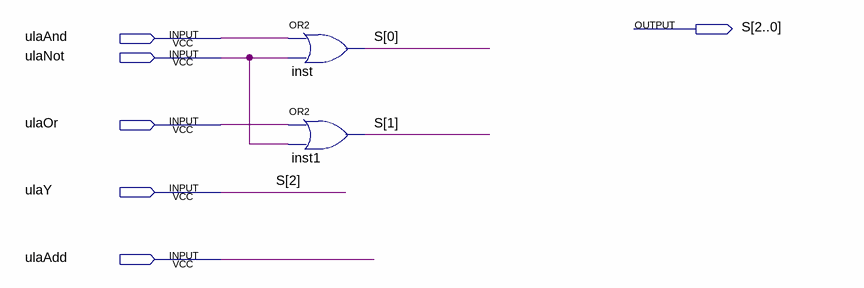
[diagram p0: schematic sheet]
// Quartus schematic codificador.bdf as structural Verilog: 2 symbols, 6 pins
module codificador (
  input  ulaAnd,
  input  ulaNot,
  input  ulaOr,
  input  ulaY,
  input  ulaAdd,
  output [2:0] S
);

  or inst (S[0], ulaAnd, ulaNot);
  or inst1 (S[1], ulaOr, ulaNot);

  assign S[2] = ulaY;
endmodule
